# EAGLE design Adafruit ADXL326 (EAGLE 6.2)
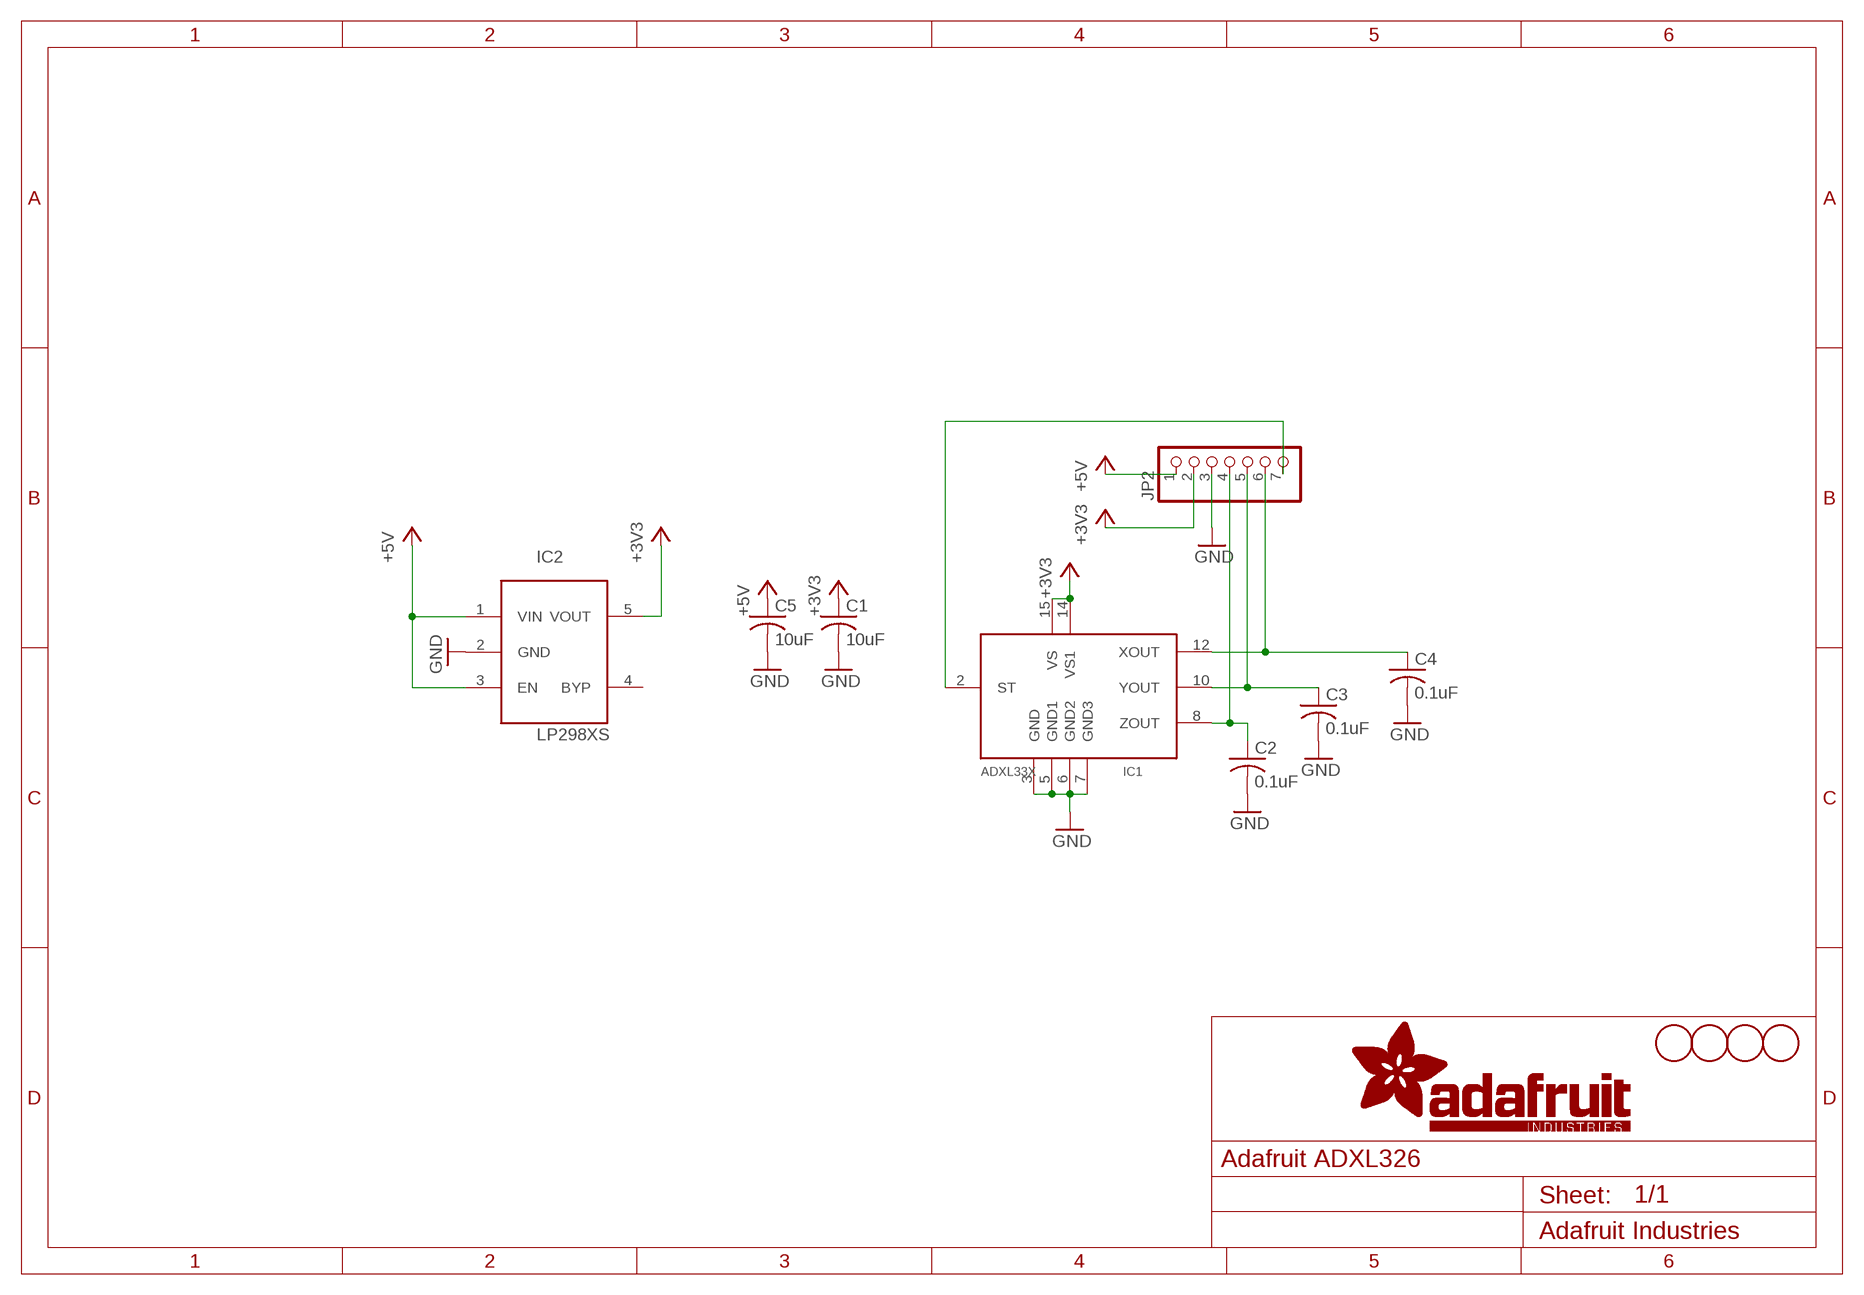
[diagram p0: schematic, sheet 1]

## Parts
C1  10uF  C-USC0805K  [C0805K]
C2  0.1uF  C-USC0805K  [C0805K]
C3  0.1uF  C-USC0805K  [C0805K]
C4  0.1uF  C-USC0805K  [C0805K]
C5  10uF  C-USC0805K  [C0805K]
IC1  ADXL33X  [16LCSP]
IC2  LP298XS  [SOT23-5L]
JP2  HEADER-1X7THICKER  [1X07_ROUND_76]
U$1  FIDUCIAL  [FIDUCIAL_1MM]
U$2  FIDUCIAL  [FIDUCIAL_1MM]
U$5  MOUNTINGHOLE2.0  [MOUNTINGHOLE_2.0_PLATED]
U$8  MOUNTINGHOLE2.0  [MOUNTINGHOLE_2.0_PLATED]

## Nets
+3V3: C1.1 IC1.14(VS1) IC1.15(VS) IC2.5(VOUT) JP2.2
+5V: C5.1 IC2.1(VIN) IC2.3(EN) JP2.1
GND: C1.2 C2.2 C3.2 C4.2 C5.2 IC1.3(GND) IC1.5(GND1) IC1.6(GND2) IC1.7(GND3) IC2.2(GND) JP2.3
ST: IC1.2(ST) JP2.7
XOUT: C4.1 IC1.12(XOUT) JP2.6
YOUT: C3.1 IC1.10(YOUT) JP2.5
ZOUT: C2.1 IC1.8(ZOUT) JP2.4
Unconnected: IC2.4(BYP)

## Library data of the parts
C1-C5 = adafruit:C-US: CAPACITOR, American symbol
IC1 = adafruit:ADXL33X
IC2 = adafruit:LP298X
JP2 = microbuilder:HEADER-1X7: PIN HEADER
U$1 U$2 = adafruit:FIDUCIAL: For use by pick and place machines to calibrate the vision/machine, 1mm By microbuilder.eu
U$5 U$8 = microbuilder:MOUNTINGHOLE: Mounting Hole

## Board
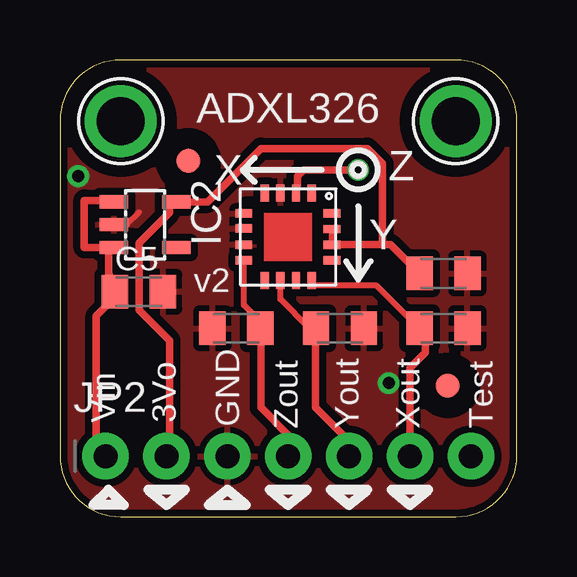
[diagram p1: board, top side]
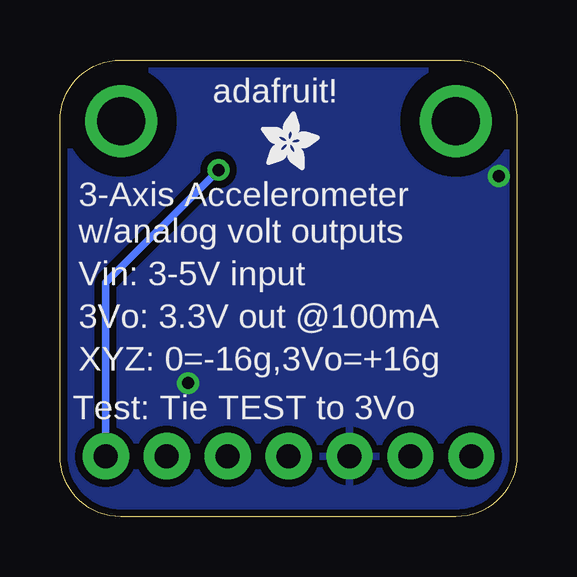
[diagram p2: board, bottom side, seen from below]

Size 19.06 x 19.05 mm. Coordinates in mm from the lower left corner, seen from the top.
Outline: 19.05,16.51 arc90 16.52,19.05 2.54,19.05 arc90 0,16.51 0,2.54 arc90 2.54,0 16.52,0 arc90 19.05,2.54 19.05,16.51
Copper layers (1*16): Top 0.035mm / dielectric 1.5mm / Bottom 0.035mm
Design rules: minimum track width 10mil, minimum drill 19mil, track to track 8mil, track to pad 8mil, pad to pad 8mil, via to via 8mil, smd to smd 8mil, copper to edge 10mil, drill to drill 8mil, minimum pad ring 10mil, minimum via ring 8mil, stop-mask expansion 4mil, vias tented up to drill 21mil, thermal gap 10mil
tRestrict: area 7.7,12.9 to 8.3,13.1; area 7.7,12.3 to 8.3,12.4; area 7.7,11.7 to 8.3,11.8

### Footprints (pad centres in the part's own frame; a part is rotated, then mirrored left to right if it is on the bottom)
C0805K = smd 1.1 x 1.4: 1 -1,0; 2 1,0
16LCSP = smd 0.7 x 0.35: 1 -1.825,0.975; 2 -1.825,0.325; 3 -1.825,-0.325; 4 -1.825,-0.975; 9 1.825,-0.975; 10 1.825,-0.325; 11 1.825,0.325; 12 1.825,0.975 | smd 0.35 x 0.7: 5 -0.975,-1.85; 6 -0.35,-1.85; 7 0.325,-1.85; 8 0.975,-1.85; 13 0.975,1.825; 14 0.325,1.825; 15 -0.325,1.825; 16 -0.975,1.825
SOT23-5L = smd 0.55 x 1.2: 1 -0.95,-1.3; 2 0,-1.3; 3 0.95,-1.3; 4 0.95,1.3; 5 -0.95,1.3
1X07_ROUND_76 = drill 1 pad 1.93: 1 -7.62,0; 2 -5.08,0; 3 -2.54,0; 4 0,0; 5 2.54,0; 6 5.08,0; 7 7.62,0
FIDUCIAL_1MM = smd 1 x 1: 1 0,0
MOUNTINGHOLE_2.0_PLATED = drill 2 pad 3: P$1 0,0

### Placement (x,y rotation side)
C1  16,10.15 0 top
C2  7.36,7.86 180 top
C3  11.68,7.86 0 top
C4  16,7.86 0 top
C5  3.3,9.39 0 top
IC1  9.52,11.67 270 top
IC2  3.55,12.18 270 top
JP2  9.52,2.53 0 top
U$1  16.17,5.47 0 top
U$2  5.35,14.85 0 top
U$4  [ADAFRUIT_2.5MM]  10.66,14.47 0 bottom
U$5  16.51,16.5 0 top
U$8  2.54,16.5 0 top

### Tracks (layer width: path | path; a pad name or v marks a point on that pad's centre or on a via)
+3V3
  Top 0.254: IC1.14 11.42,11.42 11.34,11.5 IC1.15
  Top 0.305: JP2.2 4.57,2.65 4.57,7.35 3.3,8.62 3.3,11.42 4.57,12.69 4.57,13.16 | C1.1 14.98,10.15 13.78,11.35 13.46,11.35 | 13.46,11.35 IC1.14 | 13.46,11.35 13.46,14.72 12.82,15.35 8.38,15.35 6.15,13.13 IC2.5 4.57,13.16 | 4.57,13.16 4.57,13.2
+5V
  Top 0.305: JP2.1 1.52,2.91 1.52,8.37 2.28,9.13 2.28,9.89 C5.1 2.03,10.16 2.03,11.2 IC2.3 1.01,11.23 1.01,13.2 1.93,13.2 IC2.1
GND  (via drill 0.5)
  Top 0.254: IC2.2 2.79,12.18 3.3,12.69
  other vias: 13.71,5.58 0.76,14.21
  pour Top (isolate 0.305): 0.12,19.01 0.12,-0.04 19.93,-0.04 19.93,19.01
  pour Bottom (isolate 0.305): -0.13,19.01 19.17,19.01 19.17,-0.04 -0.13,-0.04
ST  (via drill 0.5)
  Top 0.305: v12.44,14.47 10.15,14.47 9.9,14.21 9.9,13.7 9.84,13.65 IC1.2
  Bottom 0.305: JP2.7 17.14,9.77 v12.44,14.47
XOUT
  Top 0.254: IC1.12 10.49,9.64 13.2,9.64 14.98,7.86
  Top 0.305: JP2.6 14.6,6.21 15.23,6.85 15.23,7.61 14.98,7.86 C4.1
YOUT
  Top 0.254: C3.1 10.41,7.86 9.19,9.08 IC1.10
  Top 0.305: JP2.5 12.06,3.16 10.66,4.56 10.66,7.61 10.68,7.62 C3.1
ZOUT
  Top 0.254: C2.1 8.36,8.1 8.38,8.12 7.67,8.82 IC1.8
  Top 0.305: JP2.4 9.52,3.42 8.38,4.56 8.38,7.86 C2.1

### Text on the board
tPlace: ADXL326 | X | Z | Y | v2 | Vin | 3Vo | GND | Zout | Yout | Xout | Test
bPlace: adafruit! | 3-Axis Accelerometer | w/analog volt outputs | Vin: 3-5V input | 3Vo: 3.3V out @100mA | XYZ: 0=-16g,3Vo=+16g | Test: Tie TEST to 3Vo